# Altium schematic sheet Instruction Register Electronic Scheme_2021-10-21.schdoc
size 294 x 194 mm
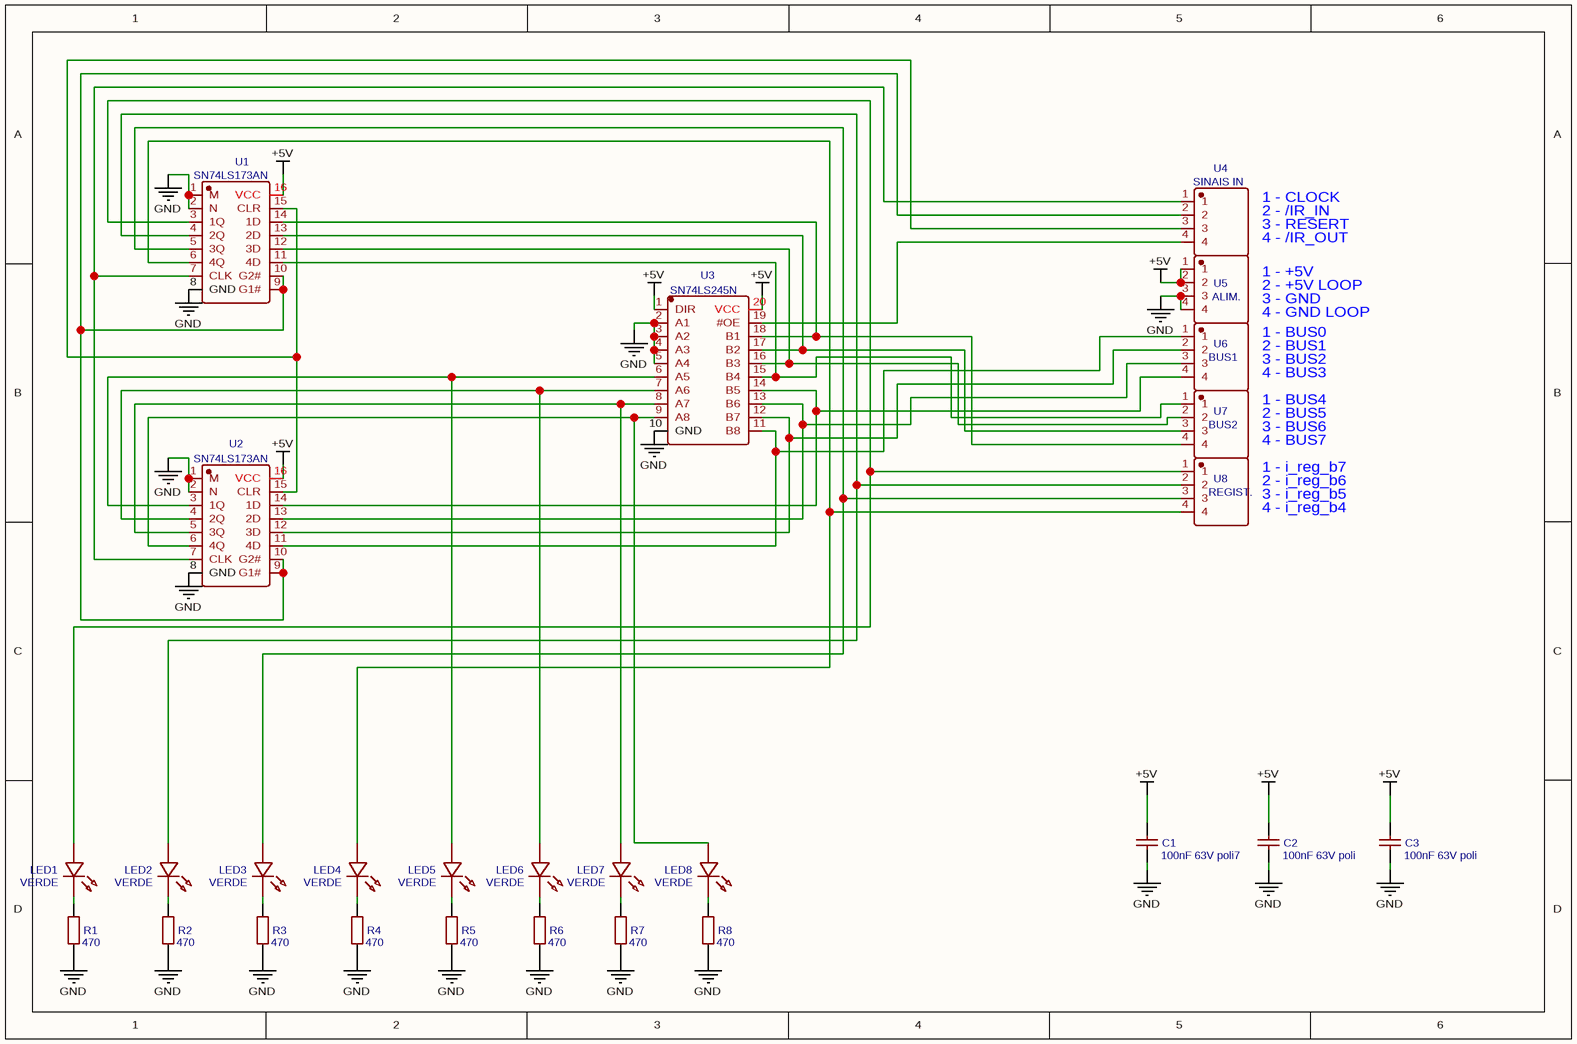
[diagram p0: Instruction Register Electronic Scheme_2021-10-21.schdoc]

## Parts
C1  100nF 63V poli7  [CAP-TH_L7.6-W3.8-P5.08-D0.51]
C2  100nF 63V poli  [CAP-TH_L7.6-W3.8-P5.08-D0.51]
C3  100nF 63V poli  [CAP-TH_L7.6-W3.8-P5.08-D0.51]
LED1  VERDE  [LED-TH_BD3.0-P2.54-RD-GREEN]
LED2  VERDE  [LED-TH_BD3.0-P2.54-RD-GREEN]
LED3  VERDE  [LED-TH_BD3.0-P2.54-RD-GREEN]
LED4  VERDE  [LED-TH_BD3.0-P2.54-RD-GREEN]
LED5  VERDE  [LED-TH_BD3.0-P2.54-RD-GREEN]
LED6  VERDE  [LED-TH_BD3.0-P2.54-RD-GREEN]
LED7  VERDE  [LED-TH_BD3.0-P2.54-RD-GREEN]
LED8  VERDE  [LED-TH_BD3.0-P2.54-RD-GREEN]
R1  470  [RES-TH_BD3.0-L9.5-P13.50-D0.6]
R2  470  [RES-TH_BD3.0-L9.5-P13.50-D0.6]
R3  470  [RES-TH_BD3.0-L9.5-P13.50-D0.6]
R4  470  [RES-TH_BD3.0-L9.5-P13.50-D0.6]
R5  470  [RES-TH_BD3.0-L9.5-P13.50-D0.6]
R6  470  [RES-TH_BD3.0-L9.5-P13.50-D0.6]
R7  470  [RES-TH_BD3.0-L9.5-P13.50-D0.6]
R8  470  [RES-TH_BD3.0-L9.5-P13.50-D0.6]
U1  SN74LS173AN  [PDIP-16_L19.7-W6.6-P2.54-LS7.6-BL]
U2  SN74LS173AN  [PDIP-16_L19.7-W6.6-P2.54-LS7.6-BL]
U3  SN74LS245N  [DIP-20_L25.5-W10.0-P2.54-LS7.6-BL]
U4  SINAIS IN  [HDR-TH_4P-P2.54-D1.0]
U5  ALIM.  [HDR-TH_4P-P2.54-D1.0]
U6  BUS1  [HDR-TH_4P-P2.54-D1.0]
U7  BUS2  [HDR-TH_4P-P2.54-D1.0]
U8  REGIST.  [HDR-TH_4P-P2.54-D1.0]

## Nets
+5V: C1.1 C2.1 C3.1 U1.16(VCC) U2.16(VCC) U3.1(DIR) U3.20(VCC) U5.1 U5.2
GND: C1.2 C2.2 C3.2 R1.2 R2.2 R3.2 R4.2 R5.2 R6.2 R7.2 R8.2 U1.1(M) U1.2(N) U1.8(GND) U2.1(M) U2.2(N) U2.8(GND) U3.2(A1) U3.3(A2) U3.4(A3) U3.5(A4) U3.10(GND) U5.3 U5.4
NetLED1_1: LED1.1(-) R1.1
NetLED1_2: LED1.2(+) U1.3(1Q) U8.1
NetLED2_1: LED2.1(-) R2.1
NetLED2_2: LED2.2(+) U1.4(2Q) U8.2
NetLED3_1: LED3.1(-) R3.1
NetLED3_2: LED3.2(+) U1.5(3Q) U8.3
NetLED4_1: LED4.1(-) R4.1
NetLED4_2: LED4.2(+) U1.6(4Q) U8.4
NetLED5_1: LED5.1(-) R5.1
NetLED5_2: LED5.2(+) U2.3(1Q) U3.6(A5)
NetLED6_1: LED6.1(-) R6.1
NetLED6_2: LED6.2(+) U2.4(2Q) U3.7(A6)
NetLED7_1: LED7.1(-) R7.1
NetLED7_2: LED7.2(+) U2.5(3Q) U3.8(A7)
NetLED8_1: LED8.1(-) R8.1
NetLED8_2: LED8.2(+) U2.6(4Q) U3.9(A8)
NetU1_7: U1.7(CLK) U2.7(CLK) U4.1
NetU1_9: U1.9(G1#) U1.10(G2#) U2.9(G1#) U2.10(G2#) U4.2
NetU1_11: U1.11(4D) U3.15(B4) U7.1
NetU1_12: U1.12(3D) U3.16(B3) U7.2
NetU1_13: U1.13(2D) U3.17(B2) U7.3
NetU1_14: U1.14(1D) U3.18(B1) U7.4
NetU1_15: U1.15(CLR) U2.15(CLR) U4.3
NetU2_11: U2.11(4D) U3.11(B8) U6.1
NetU2_12: U2.12(3D) U3.12(B7) U6.2
NetU2_13: U2.13(2D) U3.13(B6) U6.3
NetU2_14: U2.14(1D) U3.14(B5) U6.4
NetU3_19: U3.19(#OE) U4.4

## Notes on the sheet
- 1 - CLOCK
- 2 - /IR_IN
- 3 - RESERT
- 4 - /IR_OUT
- 2 - +5V LOOP
- 4 - GND LOOP
- 3 - GND
- 1 - +5V
- 4 - BUS3
- 3 - BUS2
- 1 - BUS0
- 2 - BUS1
- 2 - BUS5
- 1 - BUS4
- 3 - BUS6
- 4 - BUS7
- 4 - i_reg_b4
- 3 - i_reg_b5
- 1 - i_reg_b7
- 2 - i_reg_b6

## Library data of the parts
C1 = 100nF 63V poli7: BOM_Manufacturer: AVX; BOM_Manufacturer Part: SR305C105KAR; nameAlias: Capacitance; Contributor: LCSC; BOM_Supplier: LCSC; BOM_Supplier Part: C444741; BOM_JLCPCB Part Class: Extended Part; spicePre: C; spiceSymbolName: SR305C105KAR
C2 C3 = 100nF 63V poli: BOM_Manufacturer: AVX; BOM_Manufacturer Part: SR305C105KAR; nameAlias: Capacitance; Contributor: LCSC; BOM_Supplier: LCSC; BOM_Supplier Part: C444741; BOM_JLCPCB Part Class: Extended Part; spicePre: C; spiceSymbolName: SR305C105KAR
LED1-LED8 = VERDE: BOM_Manufacturer: Everlight Elec; BOM_Manufacturer Part: 264-7GD; Contributor: LCSC; BOM_Supplier: LCSC; BOM_Supplier Part: C605465; BOM_JLCPCB Part Class: Extended Part; spicePre: L; spiceSymbolName: 264-7GD
R1-R8 = 470: BOM_Manufacturer Part: CFR02SJ0823A10; BOM_Manufacturer: UniOhm; nameAlias: Resistance (Ohms); BOM_Supplier: LCSC; BOM_Supplier Part: C69876; spicePre: R; spiceSymbolName: CFR02SJ0823A10
U1 U2 = SN74LS173AN: BOM_Manufacturer: TI(德州仪器); Contributor: LCSC; BOM_Supplier: LCSC; BOM_Supplier Part: C1550125; BOM_Manufacturer Part: SN74LS173AN; spicePre: U; spiceSymbolName: SN74LS173AN
U3 = SN74LS245N: BOM_Manufacturer: Texas Instruments; Contributor: LCSC; BOM_Supplier: LCSC; BOM_Supplier Part: C352966; BOM_Manufacturer Part: SN74LS245N; BOM_JLCPCB Part Class: Extended Part; spicePre: U; spiceSymbolName: SN74LS245N
U4 = SINAIS IN: BOM_Manufacturer: TE Connectivity; BOM_Manufacturer Part: 171825-4; Contributor: LCSC; BOM_Supplier: LCSC; BOM_Supplier Part: C210162; BOM_JLCPCB Part Class: Extended Part; spicePre: U; spiceSymbolName: 171825-4
U5 = ALIM.: BOM_Manufacturer: TE Connectivity; BOM_Manufacturer Part: 171825-4; Contributor: LCSC; BOM_Supplier: LCSC; BOM_Supplier Part: C210162; BOM_JLCPCB Part Class: Extended Part; spicePre: U; spiceSymbolName: 171825-4
U6 = BUS1: BOM_Manufacturer: TE Connectivity; BOM_Manufacturer Part: 171825-4; Contributor: LCSC; BOM_Supplier: LCSC; BOM_Supplier Part: C210162; BOM_JLCPCB Part Class: Extended Part; spicePre: U; spiceSymbolName: 171825-4
U7 = BUS2: BOM_Manufacturer: TE Connectivity; BOM_Manufacturer Part: 171825-4; Contributor: LCSC; BOM_Supplier: LCSC; BOM_Supplier Part: C210162; BOM_JLCPCB Part Class: Extended Part; spicePre: U; spiceSymbolName: 171825-4
U8 = REGIST.: BOM_Manufacturer: TE Connectivity; BOM_Manufacturer Part: 171825-4; Contributor: LCSC; BOM_Supplier: LCSC; BOM_Supplier Part: C210162; BOM_JLCPCB Part Class: Extended Part; spicePre: U; spiceSymbolName: 171825-4